# Altium schematic sheet DAC_JESD204B.SchDoc: Sayma RTM
size 420 x 297 mm; $$Internal___BlkDate: 23:43:25_12-13-18; $$Internal_NAME_PLACEHOLDER: a3sheet; $$Internal_Resolution: 00001mm; $$NotCommonProperty_@NAME: DAC_JESD204B; $$NotCommonProperty_@PRINTORDER: 7; $$NotCommonProperty_@SHEET: 1; $$NotCommonProperty_@SHEETTOTAL: 16; $$NotCommonProperty_FORWARD_PCB: 0; CmpIndex: 243; Drawing Author: G.Kasprowicz; Drawing Number: Sayma RTM; Drawing Project: 8 channel SAWG; Drawing Revision: 2.0; SymIndex: 2227; Author: G.Kasprowicz; CompanyName: WUT ISE; DrawnBy: G.Kasprowicz; Organization: WUT ISE; Address1: PW ISE; Address2: Nowowiejska 15/19 00-665 Warsaw; Address3: gkasprow@gmail.com; DocumentNumber: 6; Revision: 1.0; SheetNumber: 6; SheetTotal: 18; ModifiedBy: -; CheckedDate: -; Title2: JESD204B DAC; DivGrp: WUT ISE; Designer: G.Kasprowicz; ModifiedDate: -; ProjectName: Sensor Box
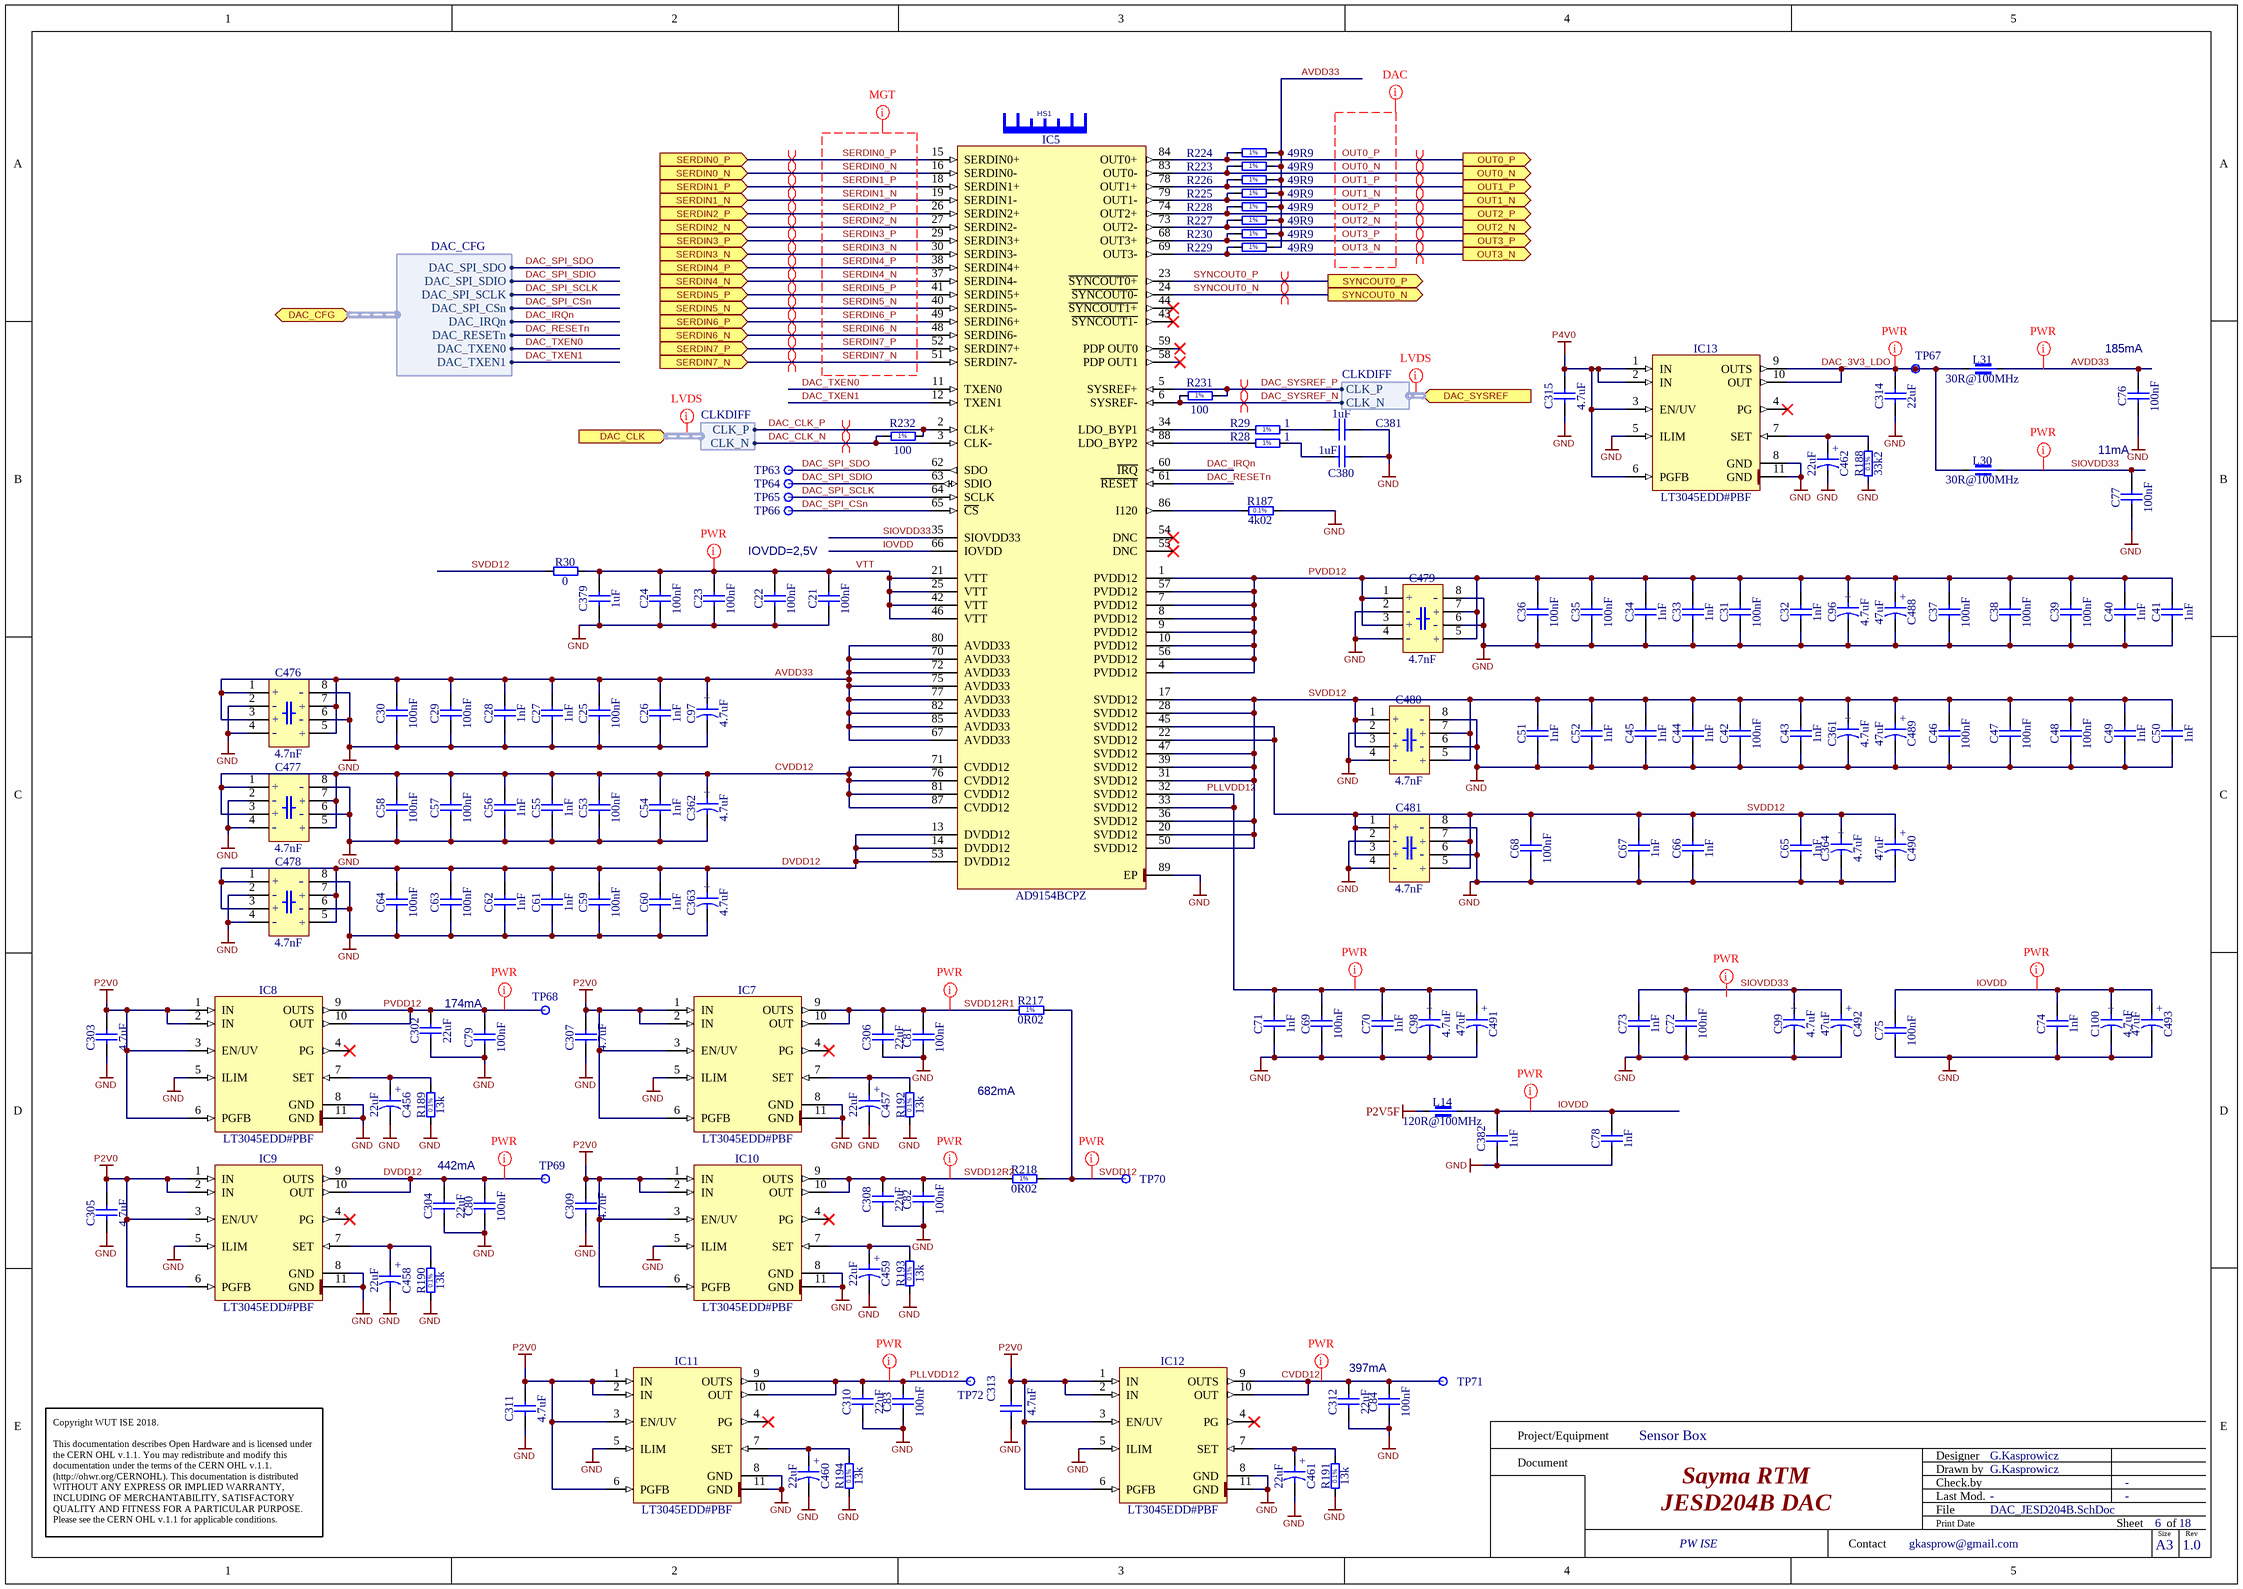
[diagram p0: DAC_JESD204B.SchDoc]

## Parts
C21  100nF  [CAPC0603X33N]
C22  100nF  [CAPC0603X33N]
C23  100nF  [CAPC0603X33N]
C24  100nF  [CAPC0603X33N]
C25  100nF  [CAPC0603X33N]
C26  1nF  [CAPC0603X33N]
C27  1nF  [CAPC0603X33N]
C28  1nF  [CAPC0603X33N]
C29  100nF  [CAPC0603X33N]
C30  100nF  [CAPC0603X33N]
C31  100nF  [CAPC0603X33N]
C32  1nF  [CAPC0603X33N]
C33  1nF  [CAPC0603X33N]
C34  1nF  [CAPC0603X33N]
C35  100nF  [CAPC0603X33N]
C36  100nF  [CAPC0603X33N]
C37  100nF  [CAPC0603X33N]
C38  100nF  [CAPC0603X33N]
C39  100nF  [CAPC0603X33N]
C40  1nF  [CAPC0603X33N]
C41  1nF  [CAPC0603X33N]
C42  100nF  [CAPC0603X33N]
C43  1nF  [CAPC0603X33N]
C44  1nF  [CAPC0603X33N]
C45  1nF  [CAPC0603X33N]
C46  100nF  [CAPC0603X33N]
C47  100nF  [CAPC0603X33N]
C48  100nF  [CAPC0603X33N]
C49  1nF  [CAPC0603X33N]
C50  1nF  [CAPC0603X33N]
C51  1nF  [CAPC0603X33N]
C52  1nF  [CAPC0603X33N]
C53  100nF  [CAPC0603X33N]
C54  1nF  [CAPC0603X33N]
C55  1nF  [CAPC0603X33N]
C56  1nF  [CAPC0603X33N]
C57  100nF  [CAPC0603X33N]
C58  100nF  [CAPC0603X33N]
C59  100nF  [CAPC0603X33N]
C60  1nF  [CAPC0603X33N]
C61  1nF  [CAPC0603X33N]
C62  1nF  [CAPC0603X33N]
C63  100nF  [CAPC0603X33N]
C64  100nF  [CAPC0603X33N]
C65  1nF  [CAPC0603X33N]
C66  1nF  [CAPC0603X33N]
C67  1nF  [CAPC0603X33N]
C68  100nF  [CAPC0603X33N]
C69  100nF  [CAPC0603X33N]
C70  1nF  [CAPC0603X33N]
C71  1nF  [CAPC0603X33N]
C72  100nF  [CAPC0603X33N]
C73  1nF  [CAPC0603X33N]
C74  1nF  [CAPC0603X33N]
C75  100nF  [CAPC0603X33N]
C76  100nF  [CAPC0603X33N]
C77  100nF  [CAPC0603X33N]
C78  1nF  [CAPC0603X33N]
C79  100nF  [CAPC0603X33N]
C80  100nF  [CAPC0603X33N]
C81  100nF  [CAPC0603X33N]
C82  100nF  [CAPC0603X33N]
C83  100nF  [CAPC0603X33N]
C84  100nF  [CAPC0603X33N]
C96  4.7uF  [CAPMP3528X210N]
C97  4.7uF  [CAPMP3528X210N]
C98  4.7uF  [CAPMP3528X210N]
C99  4.7uF  [CAPMP3528X210N]
C100  4.7uF  [CAPMP3528X210N]
C302  22uF  [CAPC2012X135N]
C303  4.7uF  [CAPC1608X90N]
C304  22uF  [CAPC2012X135N]
C305  4.7uF  [CAPC1608X90N]
C306  22uF  [CAPC2012X135N]
C307  4.7uF  [CAPC1608X90N]
C308  22uF  [CAPC2012X135N]
C309  4.7uF  [CAPC1608X90N]
C310  22uF  [CAPC2012X135N]
C311  4.7uF  [CAPC1608X90N]
C312  22uF  [CAPC2012X135N]
C313  4.7uF  [CAPC1608X90N]
C314  22uF  [CAPC2012X135N]
C315  4.7uF  [CAPC1608X90N]
C361  4.7uF  [CAPMP3528X210N]
C362  4.7uF  [CAPMP3528X210N]
C363  4.7uF  [CAPMP3528X210N]
C364  4.7uF  [CAPMP3528X210N]
C379  1uF  [CAPC1005X55N]
C380  1uF  [CAPC1005X55N]
C381  1uF  [CAPC1005X55N]
C382  1uF  [CAPC1005X55N]
C456  22uF  [CAPMP3216X180N]
C457  22uF  [CAPMP3216X180N]
C458  22uF  [CAPMP3216X180N]
C459  22uF  [CAPMP3216X180N]
C460  22uF  [CAPMP3216X180N]
C461  22uF  [CAPMP3216X180N]
C462  22uF  [CAPMP3216X180N]
C476  4.7nF  [CAPCAF50P127X203X55-8N]
C477  4.7nF  [CAPCAF50P127X203X55-8N]
C478  4.7nF  [CAPCAF50P127X203X55-8N]
C479  4.7nF  [CAPCAF50P127X203X55-8N]
C480  4.7nF  [CAPCAF50P127X203X55-8N]
C481  4.7nF  [CAPCAF50P127X203X55-8N]
C488  47uF  [CAPMP6032X280N]
C489  47uF  [CAPMP6032X280N]
C490  47uF  [CAPMP6032X280N]
C491  47uF  [CAPMP6032X280N]
C492  47uF  [CAPMP6032X280N]
C493  47uF  [CAPMP6032X280N]
HS1  17x17x2mm Heat Sink  [HSINK_17x17x2mm]  (value not drawn)
IC5  AD9154BCPZ  [QFN50P1200X1200X90-89N-S755]
IC7  LT3045EDD#PBF  [SON50P300X300X80-11N-R175X248]
IC8  LT3045EDD#PBF  [SON50P300X300X80-11N-R175X248]
IC9  LT3045EDD#PBF  [SON50P300X300X80-11N-R175X248]
IC10  LT3045EDD#PBF  [SON50P300X300X80-11N-R175X248]
IC11  LT3045EDD#PBF  [SON50P300X300X80-11N-R175X248]
IC12  LT3045EDD#PBF  [SON50P300X300X80-11N-R175X248]
IC13  LT3045EDD#PBF  [SON50P300X300X80-11N-R175X248]
L14  120R@100MHz  [INDC1608X95N]
L30  30R@100MHz  [INDC1608X95N]
L31  30R@100MHz  [INDC1608X95N]
R28  1  [RESC1005X40N]
R29  1  [RESC1005X40N]
R30  0  [RESC1005X40N]
R187  4k02  [RESC1608X55N]
R188  33k2  [RESC1608X55N]
R189  13k  [RESC1608X55N]
R190  13k  [RESC1608X55N]
R191  13k  [RESC1608X55N]
R192  13k  [RESC1608X55N]
R193  13k  [RESC1608X55N]
R194  13k  [RESC1608X55N]
R217  0R02  [RESC3216X80N]
R218  0R02  [RESC3216X80N]
R223  49R9  [RESC0603X28N]
R224  49R9  [RESC0603X28N]
R225  49R9  [RESC0603X28N]
R226  49R9  [RESC0603X28N]
R227  49R9  [RESC0603X28N]
R228  49R9  [RESC0603X28N]
R229  49R9  [RESC0603X28N]
R230  49R9  [RESC0603X28N]
R231  100  [RESC0603X28N]
R232  100  [RESC0603X28N]
TP63  Test Point  [TPS127]  (value not drawn)
TP64  Test Point  [TPS127]  (value not drawn)
TP65  Test Point  [TPS127]  (value not drawn)
TP66  Test Point  [TPS127]  (value not drawn)
TP67  Test Point  [TPS127]  (value not drawn)
TP68  Test Point  [TPS127]  (value not drawn)
TP69  Test Point  [TPS127]  (value not drawn)
TP70  Test Point  [TPS127]  (value not drawn)
TP71  Test Point  [TPS127]  (value not drawn)
TP72  Test Point  [TPS127]  (value not drawn)

## Ports
DAC_CFG (bidir, harness DAC_CFG), DAC_CLK (in, harness CLKDIFF), DAC_SYSREF (in, harness CLKDIFF), OUT0_N (out), OUT0_P (out), OUT1_N (out), OUT1_P (out), OUT2_N (out), OUT2_P (out), OUT3_N (out), OUT3_P (out), SERDIN0_N (in), SERDIN0_P (in), SERDIN1_N (in), SERDIN1_P (in), SERDIN2_N (in), SERDIN2_P (in), SERDIN3_N (in), SERDIN3_P (in), SERDIN4_N (in), SERDIN4_P (in), SERDIN5_N (in), SERDIN5_P (in), SERDIN6_N (in), SERDIN6_P (in), SERDIN7_N (in), SERDIN7_P (in), SYNCOUT0_N (out), SYNCOUT0_P (out)

## Harnesses
DAC_CFG: DAC_SPI_SDO, DAC_SPI_SDIO, DAC_SPI_SCLK, DAC_SPI_CSn, DAC_IRQn, DAC_RESETn, DAC_TXEN0, DAC_TXEN1
CLKDIFF: CLK_N, CLK_P

## Nets
GND: C21.1 C22.1 C23.1 C24.1 C25.1 C26.1 C27.1 C28.1 C29.1 C30.1 C31.1 C32.1 C33.1 C34.1 C35.1 C36.1 C37.1 C38.1 C39.1 C40.1 C41.1 C42.1 C43.1 C44.1 C45.1 C46.1 C47.1 C48.1 C49.1 C50.1 C51.1 C52.1 C53.1 C54.1 C55.1 C56.1 C57.1 C58.1 C59.1 C60.1 C61.1 C62.1 C63.1 C64.1 C65.1 C66.1 C67.1 C68.1 C69.1 C70.1 C71.1 C72.1 C73.1 C74.1 C75.1 C76.1 C77.1 C78.1 C79.1 C80.1 C81.1 C82.1 C83.1 C84.1 C96.2 C97.2 C98.2 C99.2 C100.2 C302.1 C303.1 C304.1 C305.1 C306.1 C307.1 C308.1 C309.1 C310.1 C311.1 C312.1 C313.1 C314.1 C315.1 C361.2 C362.2 C363.2 C364.2 C379.2 C380.2 C381.2 C382.2 C456.2 C457.2 C458.2 C459.2 C460.2 C461.2 C462.2 C476.2 C476.4 C476.6 C476.8 C477.2 C477.4 C477.6 C477.8 C478.2 C478.4 C478.6 C478.8 C479.2 C479.4 C479.6 C479.8 C480.2 C480.4 C480.6 C480.8 C481.2 C481.4 C481.6 C481.8 C488.2 C489.2 C490.2 C491.2 C492.2 C493.2 IC5.89(EP) IC7.5(ILIM) IC7.8(GND) IC7.11(GND) IC8.5(ILIM) IC8.8(GND) IC8.11(GND) IC9.5(ILIM) IC9.8(GND) IC9.11(GND) IC10.5(ILIM) IC10.8(GND) IC10.11(GND) IC11.5(ILIM) IC11.8(GND) IC11.11(GND) IC12.5(ILIM) IC12.8(GND) IC12.11(GND) IC13.5(ILIM) IC13.8(GND) IC13.11(GND) R187.2 R188.1 R189.1 R190.1 R191.1 R192.1 R193.1 R194.1
P2V0: C303.2 C305.2 C307.2 C309.2 C311.2 C313.2 IC7.1(IN) IC7.2(IN) IC7.3(EN/UV) IC7.6(PGFB) IC8.1(IN) IC8.2(IN) IC8.3(EN/UV) IC8.6(PGFB) IC9.1(IN) IC9.2(IN) IC9.3(EN/UV) IC9.6(PGFB) IC10.1(IN) IC10.2(IN) IC10.3(EN/UV) IC10.6(PGFB) IC11.1(IN) IC11.2(IN) IC11.3(EN/UV) IC11.6(PGFB) IC12.1(IN) IC12.2(IN) IC12.3(EN/UV) IC12.6(PGFB)
P2V5F: L14.1
P4V0: C315.2 IC13.1(IN) IC13.2(IN) IC13.3(EN/UV) IC13.6(PGFB)
AVDD33: C25.2 C26.2 C27.2 C28.2 C29.2 C30.2 C76.2 C97.1 C476.1 C476.3 C476.5 C476.7 IC5.67(AVDD33) IC5.70(AVDD33) IC5.72(AVDD33) IC5.75(AVDD33) IC5.77(AVDD33) IC5.80(AVDD33) IC5.82(AVDD33) IC5.85(AVDD33) L31.2 R223.2 R224.2 R225.2 R226.2 R227.2 R228.2 R229.2 R230.2
CVDD12: C53.2 C54.2 C55.2 C56.2 C57.2 C58.2 C84.2 C312.2 C362.1 C477.1 C477.3 C477.5 C477.7 IC5.71(CVDD12) IC5.76(CVDD12) IC5.81(CVDD12) IC5.87(CVDD12) IC12.9(OUTS) IC12.10(OUT) TP71.1
DAC_3V3_LDO: C314.2 IC13.9(OUTS) IC13.10(OUT) L30.1 L31.1 TP67.1
DAC_CLK_N: IC5.3(CLK-) R232.1 ; port DAC_CLK.CLK_N
DAC_CLK_P: IC5.2(CLK+) R232.2 ; port DAC_CLK.CLK_P
DAC_IRQn: IC5.60(~{IRQ}) ; port DAC_CFG.DAC_IRQn
DAC_RESETn: IC5.61(~{RESET}) ; port DAC_CFG.DAC_RESETn
DAC_SPI_CSn: IC5.65(~{CS}) TP66.1 ; port DAC_CFG.DAC_SPI_CSn
DAC_SPI_SCLK: IC5.64(SCLK) TP65.1 ; port DAC_CFG.DAC_SPI_SCLK
DAC_SPI_SDIO: IC5.63(SDIO) TP64.1 ; port DAC_CFG.DAC_SPI_SDIO
DAC_SPI_SDO: IC5.62(SDO) TP63.1 ; port DAC_CFG.DAC_SPI_SDO
DAC_SYSREF_N: IC5.6(SYSREF-) R231.1 ; port DAC_SYSREF.CLK_N
DAC_SYSREF_P: IC5.5(SYSREF+) R231.2 ; port DAC_SYSREF.CLK_P
DAC_TXEN0: IC5.11(TXEN0) ; port DAC_CFG.DAC_TXEN0
DAC_TXEN1: IC5.12(TXEN1) ; port DAC_CFG.DAC_TXEN1
DVDD12: C59.2 C60.2 C61.2 C62.2 C63.2 C64.2 C80.2 C304.2 C363.1 C478.1 C478.3 C478.5 C478.7 IC5.13(DVDD12) IC5.14(DVDD12) IC5.53(DVDD12) IC9.9(OUTS) IC9.10(OUT) TP69.1
IOVDD: C74.2 C75.2 C78.2 C100.1 C382.1 C493.1 IC5.66(IOVDD) L14.2
OUT0_N: IC5.83(OUT0-) R223.1 ; port OUT0_N
OUT0_P: IC5.84(OUT0+) R224.1 ; port OUT0_P
OUT1_N: IC5.79(OUT1-) R225.1 ; port OUT1_N
OUT1_P: IC5.78(OUT1+) R226.1 ; port OUT1_P
OUT2_N: IC5.73(OUT2-) R227.1 ; port OUT2_N
OUT2_P: IC5.74(OUT2+) R228.1 ; port OUT2_P
OUT3_N: IC5.69(OUT3-) R229.1 ; port OUT3_N
OUT3_P: IC5.68(OUT3+) R230.1 ; port OUT3_P
PLLVDD12: C69.2 C70.2 C71.2 C83.2 C98.1 C310.2 C491.1 IC5.32(SVDD12) IC5.33(SVDD12) IC11.9(OUTS) IC11.10(OUT) TP72.1
PVDD12: C31.2 C32.2 C33.2 C34.2 C35.2 C36.2 C37.2 C38.2 C39.2 C40.2 C41.2 C79.2 C96.1 C302.2 C479.1 C479.3 C479.5 C479.7 C488.1 IC5.1(PVDD12) IC5.4(PVDD12) IC5.7(PVDD12) IC5.8(PVDD12) IC5.9(PVDD12) IC5.10(PVDD12) IC5.56(PVDD12) IC5.57(PVDD12) IC8.9(OUTS) IC8.10(OUT) TP68.1
SERDIN0_N: IC5.16(SERDIN0-) ; port SERDIN0_N
SERDIN0_P: IC5.15(SERDIN0+) ; port SERDIN0_P
SERDIN1_N: IC5.19(SERDIN1-) ; port SERDIN1_N
SERDIN1_P: IC5.18(SERDIN1+) ; port SERDIN1_P
SERDIN2_N: IC5.27(SERDIN2-) ; port SERDIN2_N
SERDIN2_P: IC5.26(SERDIN2+) ; port SERDIN2_P
SERDIN3_N: IC5.30(SERDIN3-) ; port SERDIN3_N
SERDIN3_P: IC5.29(SERDIN3+) ; port SERDIN3_P
SERDIN4_N: IC5.37(SERDIN4-) ; port SERDIN4_N
SERDIN4_P: IC5.38(SERDIN4+) ; port SERDIN4_P
SERDIN5_N: IC5.40(SERDIN5-) ; port SERDIN5_N
SERDIN5_P: IC5.41(SERDIN5+) ; port SERDIN5_P
SERDIN6_N: IC5.48(SERDIN6-) ; port SERDIN6_N
SERDIN6_P: IC5.49(SERDIN6+) ; port SERDIN6_P
SERDIN7_N: IC5.51(SERDIN7-) ; port SERDIN7_N
SERDIN7_P: IC5.52(SERDIN7+) ; port SERDIN7_P
SIOVDD33: C72.2 C73.2 C77.2 C99.1 C492.1 IC5.35(SIOVDD33) L30.2
SVDD12: C42.2 C43.2 C44.2 C45.2 C46.2 C47.2 C48.2 C49.2 C50.2 C51.2 C52.2 C65.2 C66.2 C67.2 C68.2 C361.1 C364.1 C480.1 C480.3 C480.5 C480.7 C481.1 C481.3 C481.5 C481.7 C489.1 C490.1 IC5.17(SVDD12) IC5.20(SVDD12) IC5.22(SVDD12) IC5.28(SVDD12) IC5.31(SVDD12) IC5.36(SVDD12) IC5.39(SVDD12) IC5.45(SVDD12) IC5.47(SVDD12) IC5.50(SVDD12) R30.1 R217.2 R218.2 TP70.1
SVDD12R1: C81.2 C306.2 IC7.9(OUTS) IC7.10(OUT) R217.1
SVDD12R2: C82.2 C308.2 IC10.9(OUTS) IC10.10(OUT) R218.1
SYNCOUT0_N: IC5.24(~{SYNCOUT0-}) ; port SYNCOUT0_N
SYNCOUT0_P: IC5.23(~{SYNCOUT0+}) ; port SYNCOUT0_P
VTT: C21.2 C22.2 C23.2 C24.2 C379.1 IC5.21(VTT) IC5.25(VTT) IC5.42(VTT) IC5.46(VTT) R30.2
NetC380_1: C380.1 R28.2
NetC381_1: C381.1 R29.2
NetC456_1: C456.1 IC8.7(SET) R189.2
NetC457_1: C457.1 IC7.7(SET) R192.2
NetC458_1: C458.1 IC9.7(SET) R190.2
NetC459_1: C459.1 IC10.7(SET) R193.2
NetC460_1: C460.1 IC11.7(SET) R194.2
NetC461_1: C461.1 IC12.7(SET) R191.2
NetC462_1: C462.1 IC13.7(SET) R188.2
NetIC5_34: IC5.34(LDO_BYP1) R29.1
NetIC5_86: IC5.86(I120) R187.1
NetIC5_88: IC5.88(LDO_BYP2) R28.1

Not connected (* = marked no-connect by the designer): IC5 43(~{SYNCOUT1-})* 44(~{SYNCOUT1+})* 54(DNC)* 55(DNC)* 58(PDP_OUT1)* 59(PDP_OUT0)*; IC7 4(PG)*; IC8 4(PG)*; IC9 4(PG)*; IC10 4(PG)*; IC11 4(PG)*; IC12 4(PG)*; IC13 4(PG)*

## Layout directives
differential pair: DAC_CLK_N, DAC_CLK_P, DAC_SYSREF_N, DAC_SYSREF_P, OUT0_N, OUT0_P, OUT1_N, OUT1_P, OUT2_N, OUT2_P, OUT3_N, OUT3_P, SERDIN0_N, SERDIN0_P, SERDIN1_N, SERDIN1_P, SERDIN2_N, SERDIN2_P, SERDIN3_N, SERDIN3_P, SERDIN4_N, SERDIN4_P, SERDIN5_N, SERDIN5_P, SERDIN6_N, SERDIN6_P, SERDIN7_N, SERDIN7_P, SYNCOUT0_N, SYNCOUT0_P
net class DAC: OUT0_N, OUT0_P, OUT1_N, OUT1_P, OUT2_N, OUT2_P, OUT3_N, OUT3_P
net class PWR: (no net found under the mark), AVDD33, CVDD12, DAC_3V3_LDO, DVDD12, IOVDD, PLLVDD12, PVDD12, SIOVDD33, SVDD12, SVDD12R1, SVDD12R2, VTT
net class MGT: SERDIN0_N, SERDIN0_P, SERDIN1_N, SERDIN1_P, SERDIN2_N, SERDIN2_P, SERDIN3_N, SERDIN3_P, SERDIN4_N, SERDIN4_P, SERDIN5_N, SERDIN5_P, SERDIN6_N, SERDIN6_P, SERDIN7_N, SERDIN7_P
net class LVDS: (no net found under the mark)

## Notes on the sheet
- (near C76) 185mA
- 11mA
- IOVDD=2,5V
- 174mA
- 682mA
- 442mA
- 397mA
- Project/Equipment
- Document
- Designer
- Drawn by
- Check.by
- Copyright WUT ISE 2018.
  This documentation describes Open Hardware and is licensed under the CERN OHL v.1.1. You may redistribute and modify this documentation under the terms of the CERN OHL v.1.1. (http://ohwr.org/CERNOHL). This documentation is distributed WITHOUT ANY EXPRESS OR IMPLIED WARRANTY, INCLUDING OF MERCHANTABILITY, SATISFACTORY QUALITY AND FITNESS FOR A PARTICULAR PURPOSE. Please see the CERN OHL v.1.1 for applicable conditions.
- Contact
- File
- Last Mod.
- Print Date
- Sheet
- Size
- A3
- of
- Rev
- (in symbol CC0508_4.7NF_6.3V_20%_X7R_AVX_W2L16C473MAT1S) +; -
- (in symbol CTE3216-18_22UF_6.3V_10%_LESR0900) +
- (in symbol CTE3528-21_4.7UF_35V_10%) +
- (in symbol CTE6032-28_47UF_16V_10%_LESR0350) +
- (in symbol R0201_100R_1%_0.05W_200PPM) 1%
- (in symbol R0402_1R_1%_0.0625W_200PPM) 1%
- (in symbol R0603_4K02_0.1%_0.063W_10PPM) 0.1%
- (in symbol R0603_13K_0.1%_0.063W_10PPM) 0.1%
- (in symbol R0603_33K2_0.1%_0.063W_10PPM) 0.1%
- (in symbol R1206_0R02_1%_0.5W_100PPM) 1%
- (in symbol RES_0201_1k_49R9) 1%

## Library data of the parts
C21-C25 C29-C31 C35-C39 C42 C46-C48 C53 C57-C59 C63 C64 C68 C69 C72 C75-C77 C79-C84 = CC0201_100NF_6.3V_10%_X5R: Non-polarised capacitor; Manufacturer: GENERIC; Manufacturer1 Part Number: 02016D104KAT2A; Part Description: SMD Multilayer Chip Ceramic Capacitor; TC: X5R; Tolerance: ±10%; Voltage: 6.3V; Case: 0201; Manufacturer Part Number: CC0201_100NF_6.3V_10%_X5R; Manufacturer1 Example: AVX; Part Number: CC0201_100NF_6.3V_10%_X5R; Pin Count: 2; SMD: Yes; Status: Not Recommended; Value: 100nF; Component Kind: Standard; Component Type: Standard; Mounted: Yes; Socket: No; Sense: No; Manufacturer1 ComponentHeight: 0.33mm; HelpURL: \\cern.ch\dfs\Applications\Altium\Datasheets\CC0201_X5R_AVX.pdf; Author: CERN DEM JLC; CreateDate: 03.12.2007; LatestRevisionDate: 03.12.2007
C26-C28 C32-C34 C40 C41 C43-C45 C49-C52 C54-C56 C60-C62 C65-C67 C70 C71 C73 C74 C78 = CC0201_1NF_16V_10%_X5R: Non-polarised capacitor; Manufacturer: GENERIC; Manufacturer1 Part Number: 0201YD102KAT2A; Part Description: SMD Multilayer Chip Ceramic Capacitor; Tolerance: ±10%; Voltage: 16V; TC: X5R; Case: 0201; Manufacturer Part Number: CC0201_1NF_16V_10%_X5R; Manufacturer1 Example: AVX; Part Number: CC0201_1NF_16V_10%_X5R; Pin Count: 2; SMD: Yes; Value: 1nF; Component Kind: Standard; Component Type: Standard; Status: Not Recommended; Mounted: Yes; Socket: No; Sense: No; Manufacturer1 ComponentHeight: 0.33mm; HelpURL: \\cern.ch\dfs\Applications\Altium\Datasheets\CC0201_X5R_AVX.pdf; Author: CERN DEM JLC; CreateDate: 03.12.2007; LatestRevisionDate: 03.12.2007
C96-C100 C361-C364 = CTE3528-21_4.7UF_35V_10%: Polarised capacitor; Manufacturer: GENERIC; Manufacturer1 Part Number: TAJB475K035R; Part Description: Solid Tantalum Chip Capacitor; Tolerance: ±10%; Voltage: 35V; Case: B; Manufacturer Part Number: CTE3528-21_4.7UF_35V_10%; Manufacturer1 Example: AVX; Part Number: CTE3528-21_4.7UF_35V_10%; Pin Count: 2; SMD: Yes; Value: 4.7uF; Component Kind: Standard; Component Type: Standard; Status: Preferred; Mounted: Yes; Socket: No; Sense: No; Manufacturer1 ComponentHeight: 2.1mm; HelpURL: \\cern.ch\dfs\Applications\Altium\Datasheets\CTE_AVX_TAJ.pdf; Author: CERN DEM JLC; CreateDate: 03.12.2007; LatestRevisionDate: 03.12.2007
C302 C304 C306 C308 C310 C312 C314 = CC0805_22UF_16V_10%_X5R: Non-polarised capacitor; Manufacturer: GENERIC; Manufacturer1 Part Number: C2012X5R1C226KT; Part Description: SMD Multilayer Chip Ceramic Capacitor; Tolerance: ±10%; Voltage: 16V; TC: X5R; Case: 0805; Manufacturer Part Number: CC0805_22UF_16V_10%_X5R; Manufacturer1 Example: TDK; Part Number: CC0805_22UF_16V_10%_X5R; Pin Count: 2; SMD: Yes; Value: 22uF; Component Kind: Standard; Component Type: Standard; Status: Preferred; Mounted: Yes; Socket: No; Sense: No; Manufacturer1 ComponentHeight: 1.35mm; HelpURL: \\cern.ch\dfs\Applications\Altium\Datasheets\CC0805_X5R_TDK_C.pdf; Author: CERN DEM JLC; CreateDate: 25.10.2012; LatestRevisionDate: 25.10.2012
C303 C305 C307 C309 C311 C313 C315 = CC0603_4.7UF_25V_10%_X5R: Non-polarised capacitor; Manufacturer: GENERIC; Manufacturer1 Part Number: GRM188R61E475KE11D; Part Description: SMD Multilayer Chip Ceramic Capacitor; Tolerance: ±10%; Voltage: 25V; TC: X5R; Case: 0603; Manufacturer Part Number: CC0603_4.7UF_25V_10%_X5R; Manufacturer1 Example: MURATA; Part Number: CC0603_4.7UF_25V_10%_X5R; Pin Count: 2; SMD: Yes; Value: 4.7uF; Component Kind: Standard; Component Type: Standard; Status: None; Mounted: Yes; Socket: No; Sense: No; Manufacturer1 ComponentHeight: 0.95mm; HelpURL: \\cern.ch\dfs\Applications\Altium\Datasheets\CC0603_MURATA_GRM188R61E475KE11D.pdf; Author: CERN DEM JLC; CreateDate: 10.11.2014; LatestRevisionDate: 10.11.2014
C379-C382 = CC0402_1UF_16V_10%_X5R: Non-polarised capacitor; Manufacturer: GENERIC; Manufacturer1 Part Number: C1005X5R1C105KT; Part Description: SMD Multilayer Chip Ceramic Capacitor; TC: X5R; Tolerance: ±10%; Voltage: 16V; Case: 0402; Manufacturer Part Number: CC0402_1UF_16V_10%_X5R; Manufacturer1 Example: TDK; Part Number: CC0402_1UF_16V_10%_X5R; Pin Count: 2; SMD: Yes; Status: Preferred; Value: 1uF; Component Kind: Standard; Component Type: Standard; Mounted: Yes; Socket: No; Sense: No; Manufacturer1 ComponentHeight: 0.55mm; HelpURL: \\cern.ch\dfs\Applications\Altium\Datasheets\CC0402_X5R_TDK_C.pdf; Author: CERN DEM JLC; CreateDate: 25.10.2012; LatestRevisionDate: 25.10.2012
C456-C462 = CTE3216-18_22UF_6.3V_10%_LESR0900: Polarised capacitor; Manufacturer: GENERIC; Manufacturer1 Part Number: TPSA226K006R0900; Part Description: Low ESR 0R9 Solid Tantalum Chip Capacitor; Tolerance: ±10%; Voltage: 6.3V; Case: A; Manufacturer Part Number: CTE3216-18_22UF_6.3V_10%_LESR0900; Manufacturer1 Example: AVX; Part Number: CTE3216-18_22UF_6.3V_10%_LESR0900; Pin Count: 2; SMD: Yes; Status: Preferred; Value: 22uF; Component Kind: Standard; Component Type: Standard; Mounted: Yes; Socket: No; Sense: No; Manufacturer1 ComponentHeight: 1.8mm; HelpURL: \\cern.ch\dfs\Applications\Altium\Datasheets\CTE-LESR_AVX_TPS.pdf; Author: CERN DEM JLC; CreateDate: 05.05.2008; LatestRevisionDate: 20.01.2009
C476-C481 = CC0508_4.7NF_6.3V_20%_X7R_AVX_W2L16C473MAT1S: IDC (InterDigitated Capacitors) Low Inductance Capacitors; Manufacturer: AVX; TC: X7R; Tolerance: ±20%; Voltage: 6.3V; Author: CERN DEM JLC; Case: 0508; Component Kind: Standard; Component Type: Standard; ComponentHeight: 0.55mm; CreateDate: 01.12.2016; HelpURL: \\cern.ch\dfs\Applications\Altium\Datasheets\CC0508_X7R_AVX_W2L.pdf; LatestRevisionDate: 01.12.2016; Manufacturer Part Number: W2L16C473MAT1S; Mounted: Yes; Part Description: IDC (InterDigitated Capacitors) Low Inductance Capacitor; Part Number: CC0508_4.7NF_6.3V_20%_X7R_AVX_W2L16C473MAT1S; Pin Count: 8; Sense: No; SMD: Yes; Socket: No; Status: None; Value: 4.7nF
C488-C493 = CTE6032-28_47UF_16V_10%_LESR0350: Polarised capacitor; Manufacturer: GENERIC; Manufacturer1 Part Number: TPSC476K016R0350; Part Description: Low ESR 0R350 Solid Tantalum Chip Capacitor; Tolerance: ±10%; Voltage: 16V; Case: C; Manufacturer Part Number: CTE6032-28_47UF_16V_10%_LESR0350; Manufacturer1 Example: AVX; Part Number: CTE6032-28_47UF_16V_10%_LESR0350; Pin Count: 2; SMD: Yes; Value: 47uF; Component Kind: Standard; Component Type: Standard; Status: Preferred; Mounted: Yes; Socket: No; Sense: No; Manufacturer1 ComponentHeight: 2.8mm; HelpURL: \\cern.ch\dfs\Applications\Altium\Datasheets\CTE-LESR_AVX_TPS.pdf; Author: CERN DEM JLC; CreateDate: 05.05.2008; LatestRevisionDate: 20.01.2009
HS1 = Heat_sink_17x17x2mm: Part Number: HSINK_17x17x2; Part Description: custom 17x17x2mm heat sink; Manufacturer: MoreSuns; Manufacturer Part Number: 17x17x2mm aluminium heat sink; PressFit: No; Component Kind: Standard; Component Type: Standard; Footprint: HSINK_17x17x2; Pin Count: 0; PackageDescription: custom 17x17x2mm heat sink; Mounted: Yes; Socket: No; SMD: No; Sense: No; Status: None; ComponentHeight: 12mm; HelpURL: \\cern.ch\dfs\Applications\Altium\Datasheets\HSINK_CTS_AER27-27-12CB.pdf; Author: GK; CreateDate: 02.02.2016; LatestRevisionDate: 02.02.2016
IC5 = AD9154BCPZ: Quad, 16-Bit, 2.4 GSPS, TxDAC+® Digital-to-Analog Converter; Manufacturer: ANALOG DEVICES; Bonding: No; PressFit: No; Author: CERN DEM MR; Case: QFN88; Component Kind: Standard; Component Type: Standard; ComponentHeight: 0.9mm; CreateDate: 15.02.2016; Device: AD9154BCPZ; HelpURL: \\cern.ch\dfs\Applications\Altium\Datasheets\AD9154BCPZ.pdf; LatestRevisionDate: 15.02.2016; Manufacturer Part Number: AD9154BCPZ; Mounted: Yes; PackageDescription: QFN, 0.50mm pitch, Square; 22 pin X 22 pin, 12.00mm X 12.00mm (W/Thermal Tab 7.55mm X 7.55mm), IPC Medium Density; Part Description: Quad, 16-Bit, 2.4 GSPS, TxDAC+® Digital-to-Analog Converter; Part Number: AD9154BCPZ; Pin Count: 89; Sense: No; SMD: Yes; Socket: No
IC7-IC13 = LT3045EDD#PBF: 20V, 500mA, Ultralow Noise, Ultrahigh PSRR Linear Regulator; Manufacturer: LINEAR TECHNOLOGY; PressFit: No; Bonding: No; Case: SON10; ComponentHeight: 0.8mm; Device: LT3045EDD#PBF; Manufacturer Part Number: LT3045EDD#PBF; PackageDescription: SON, 0.50mm Pitch, 10-pin, 3.00mm W  X 3.00mm L X 0.80mm Height, (w/thermal tab 1.75 X 2.48 mm), IPC Medium Density; Part Description: 20V, 500mA, Ultralow Noise, Ultrahigh PSRR Linear Regulator; Part Number: LT3045EDD#PBF; Pin Count: 11; SMD: Yes; Component Kind: Standard; Component Type: Standard; Mounted: Yes; Socket: No; Sense: No; HelpURL: \\cern.ch\dfs\Applications\Altium\Datasheets\LT3045EDD#PBF.pdf; Author: CERN DEM JLC; CreateDate: 07.12.2016; LatestRevisionDate: 07.12.2016
L14 = IND0603_MURATA_BLM18PG121SN1D: Manufacturer: MURATA; Part Description: SMD EMIFIL Chip Ferrite Bead; Power: 2A; Resistance: 0.05R; Case: 0603; ComponentHeight: 0.95mm; Manufacturer Part Number: BLM18PG121SN1D; Part Number: IND0603_MURATA_BLM18PG121SN1D; Pin Count: 2; SMD: Yes; Value: 120R@100MHz; Component Kind: Standard; Component Type: Standard; Status: None; Mounted: Yes; Socket: No; Sense: No; HelpURL: \\cern.ch\dfs\Applications\Altium\Datasheets\IND0603_MURATA_BLM18P.pdf; Author: CERN DEM BC; CreateDate: 27.07.2015; LatestRevisionDate: 25.10.2018
L30 L31 = IND0603_MURATA_BLM18PG300SN1D: Manufacturer: MURATA; Part Description: SMD EMIFIL Chip Ferrite Bead; Power: 1A; Resistance: 0.05R; Case: 0603; ComponentHeight: 0.95mm; Manufacturer Part Number: BLM18PG300SN1D; Part Number: IND0603_MURATA_BLM18PG300SN1D; Pin Count: 2; SMD: Yes; Value: 30R@100MHz; Component Kind: Standard; Component Type: Standard; Status: None; Mounted: Yes; Socket: No; Sense: No; HelpURL: \\cern.ch\dfs\Applications\Altium\Datasheets\IND0603_MURATA_BLM18P.pdf; Author: CERN DEM JMW; CreateDate: 19.02.2014; LatestRevisionDate: 25.10.2018
R28 R29 = R0402_1R_1%_0.0625W_200PPM: Resistor - 1%; Manufacturer: GENERIC; Manufacturer1 Part Number: 232270671008L; Part Description: General Purpose Thick Film Chip Resistor; TC: ±200ppm/°C; PressFit: No; Case: 0402; Manufacturer Part Number: R0402_1R_1%_0.0625W_200PPM; Manufacturer1 ComponentHeight: 0.4mm; Manufacturer1 Example: YAGEO PHYCOMP; Part Number: R0402_1R_1%_0.0625W_200PPM; Pin Count: 2; Power: 0.0625W; Sense: No; SMD: Yes; Status: Not Recommended; Tolerance: ±1%; Value: 1; Component Kind: Standard; Component Type: Standard; Mounted: Yes; Socket: No; HelpURL: \\cern.ch\dfs\Applications\Altium\Datasheets\R0402_Phycomp_RC0402.pdf; Author: CERN DEM JLC; CreateDate: 03.12.2007; LatestRevisionDate: 17.10.2012
R30 = R0402_0R_JUMPER: Resistor; Manufacturer: GENERIC; Manufacturer1 Part Number: 232270591001L; Part Description: 1A (0.05R Max DC Resistance) Zero Ohm Jumper; PressFit: No; Case: 0402; Manufacturer Part Number: R0402_0R_JUMPER; Manufacturer1 ComponentHeight: 0.4mm; Manufacturer1 Example: YAGEO PHYCOMP; Part Number: R0402_0R_JUMPER; Pin Count: 2; Sense: No; SMD: Yes; Status: Not Recommended; Value: 0; Component Kind: Standard; Component Type: Standard; Mounted: Yes; Socket: No; HelpURL: \\cern.ch\dfs\Applications\Altium\Datasheets\R0402_Phycomp_RC0402.pdf; Author: CERN DEM JLC; CreateDate: 03.12.2007; LatestRevisionDate: 17.10.2012
R187 = R0603_4K02_0.1%_0.063W_10PPM: Resistor - 0.1%; Manufacturer: GENERIC; Manufacturer1 Part Number: RN73C1J4K02BTDF; Part Description: Thin Film Chip Resistor; Power: 0.063W; TC: ±10ppm; PressFit: No; Case: 0603; Manufacturer Part Number: R0603_4K02_0.1%_0.063W_10PPM; Manufacturer1 ComponentHeight: 0.5mm; Manufacturer1 Example: TYCO HOLSWORTHY; Part Number: R0603_4K02_0.1%_0.063W_10PPM; Pin Count: 2; Sense: No; SMD: Yes; Status: Not Recommended; Tolerance: ±0.1%; Value: 4k02; Component Kind: Standard; Component Type: Standard; Mounted: Yes; Socket: No; HelpURL: \\cern.ch\dfs\Applications\Altium\Datasheets\R0603_Tyco_RN73.pdf; Author: CERN DEM JLC; CreateDate: 03.12.2007; LatestRevisionDate: 13.03.2008
R188 = R0603_33K2_0.1%_0.063W_10PPM: Resistor - 0.1%; Manufacturer: GENERIC; Manufacturer1 Part Number: RN73C1J33K2BTDF; Part Description: Thin Film Chip Resistor; Power: 0.063W; TC: ±10ppm; PressFit: No; Case: 0603; Manufacturer Part Number: R0603_33K2_0.1%_0.063W_10PPM; Manufacturer1 ComponentHeight: 0.5mm; Manufacturer1 Example: TYCO HOLSWORTHY; Part Number: R0603_33K2_0.1%_0.063W_10PPM; Pin Count: 2; Sense: No; SMD: Yes; Status: Not Recommended; Tolerance: ±0.1%; Value: 33k2; Component Kind: Standard; Component Type: Standard; Mounted: Yes; Socket: No; HelpURL: \\cern.ch\dfs\Applications\Altium\Datasheets\R0603_Tyco_RN73.pdf; Author: CERN DEM JLC; CreateDate: 03.12.2007; LatestRevisionDate: 13.03.2008
R189-R194 = R0603_13K_0.1%_0.063W_10PPM: Resistor - 0.1%; Manufacturer: GENERIC; Manufacturer1 Part Number: RN73C1J13KBTDF; Part Description: Thin Film Chip Resistor; Power: 0.063W; TC: ±10ppm; PressFit: No; Case: 0603; Manufacturer Part Number: R0603_13K_0.1%_0.063W_10PPM; Manufacturer1 ComponentHeight: 0.5mm; Manufacturer1 Example: TYCO HOLSWORTHY; Part Number: R0603_13K_0.1%_0.063W_10PPM; Pin Count: 2; Sense: No; SMD: Yes; Status: Not Recommended; Tolerance: ±0.1%; Value: 13k; Component Kind: Standard; Component Type: Standard; Mounted: Yes; Socket: No; HelpURL: \\cern.ch\dfs\Applications\Altium\Datasheets\R0603_Tyco_RN73.pdf; Author: CERN DEM JLC; CreateDate: 03.12.2007; LatestRevisionDate: 13.03.2008
R217 R218 = R1206_0R02_1%_0.5W_100PPM: Resistor - 1%; Manufacturer Part Number: LRF1206-R020FI; Manufacturer: TT Electronics; Part Description: Low Value Flat Chip Resistor; Power: 0.5W; TC: ±100ppm/°C; PressFit: No; Case: 1206; ComponentHeight: 0.8mm; Part Number: R1206_0R02_1%_0.5W_100PPM; Pin Count: 2; Sense: No; SMD: Yes; Status: None; Tolerance: ±1%; Value: 0R02; Component Kind: Standard; Component Type: Standard; Mounted: Yes; Socket: No; HelpURL: \\cern.ch\dfs\Applications\Altium\Datasheets\R1206_WELWYN_LRF.pdf; Author: CERN DEM JLC; CreateDate: 11.05.2010; LatestRevisionDate: 03.09.2012
R223-R230 = RES_0201_1k_49R9: 49R9k, 0201, 1%; Manufacturer Part Number: R0201_49R9_1%_0.05W_200PPM; Manufacturer: GENERIC; Part Description: Thick Film Chip Resistor; Part Number: R0201_1K_1%_0.05W_200PPM; Manufacturer1 Part Number: CRCW020149R9FNED; Power: 0.05W; TC: ±200ppm/°C; Table: Resistors SMD; Case: 0201; Manufacturer1 ComponentHeight: 0.27mm; Manufacturer1 Example: VISHAY; Pin Count: 2; SMD: Yes; Status: Not recommended; Tolerance: ±1%; Value: 49R9; Component Kind: Standard; Component Type: Standard; Mounted: Yes; Socket: No; HelpURL: \\cern.ch\dfs\Applications\Altium\Datasheets\R0201_VISHAY_CRCW e3.pdf; Author: GK; CreateDate: 2014-11-13; LatestRevisionDate: 2014-11-13
R231 R232 = R0201_100R_1%_0.05W_200PPM: Resistor - 1%; Manufacturer: GENERIC; Manufacturer1 Part Number: CRCW0201100RFNED; Part Description: Thick Film Chip Resistor; Power: 0.05W; TC: ±200ppm/°C; PressFit: No; Case: 0201; Manufacturer Part Number: R0201_100R_1%_0.05W_200PPM; Manufacturer1 ComponentHeight: 0.27mm; Manufacturer1 Example: VISHAY; Part Number: R0201_100R_1%_0.05W_200PPM; Pin Count: 2; Sense: No; SMD: Yes; Status: Not Recommended; Tolerance: ±1%; Value: 100; Component Kind: Standard; Component Type: Standard; Mounted: Yes; Socket: No; HelpURL: \\cern.ch\dfs\Applications\Altium\Datasheets\R0201_VISHAY_CRCW0201 e3.pdf; Author: CERN DEM JLC; CreateDate: 13.11.2014; LatestRevisionDate: 13.11.2014
TP63-TP72 = SMD_PAD_1.27X1.27MM: Part Description: 1.27mm x 1.27mm PCB Copper Area (SMD Test Point); Mounted: No; ComponentHeight: 0mm; Family: Test Point; Part Number: SMD_PAD_1.27X1.27MM; Pin Count: 1; Sense: No; SMD: Yes; Socket: No; Status: None; Component Kind: Standard (No BOM); Component Type: Standard (No BOM); HelpURL: Undefined; Author: CERN DEM JLC; CreateDate: 12.01.2008; LatestRevisionDate: 12.01.2008; PackageDescription: 1.27mm x 1.27mm PCB Copper Area (SMD Test Point)